# EAGLE design LED individual sign Board FINAL (EAGLE 7.2.0)
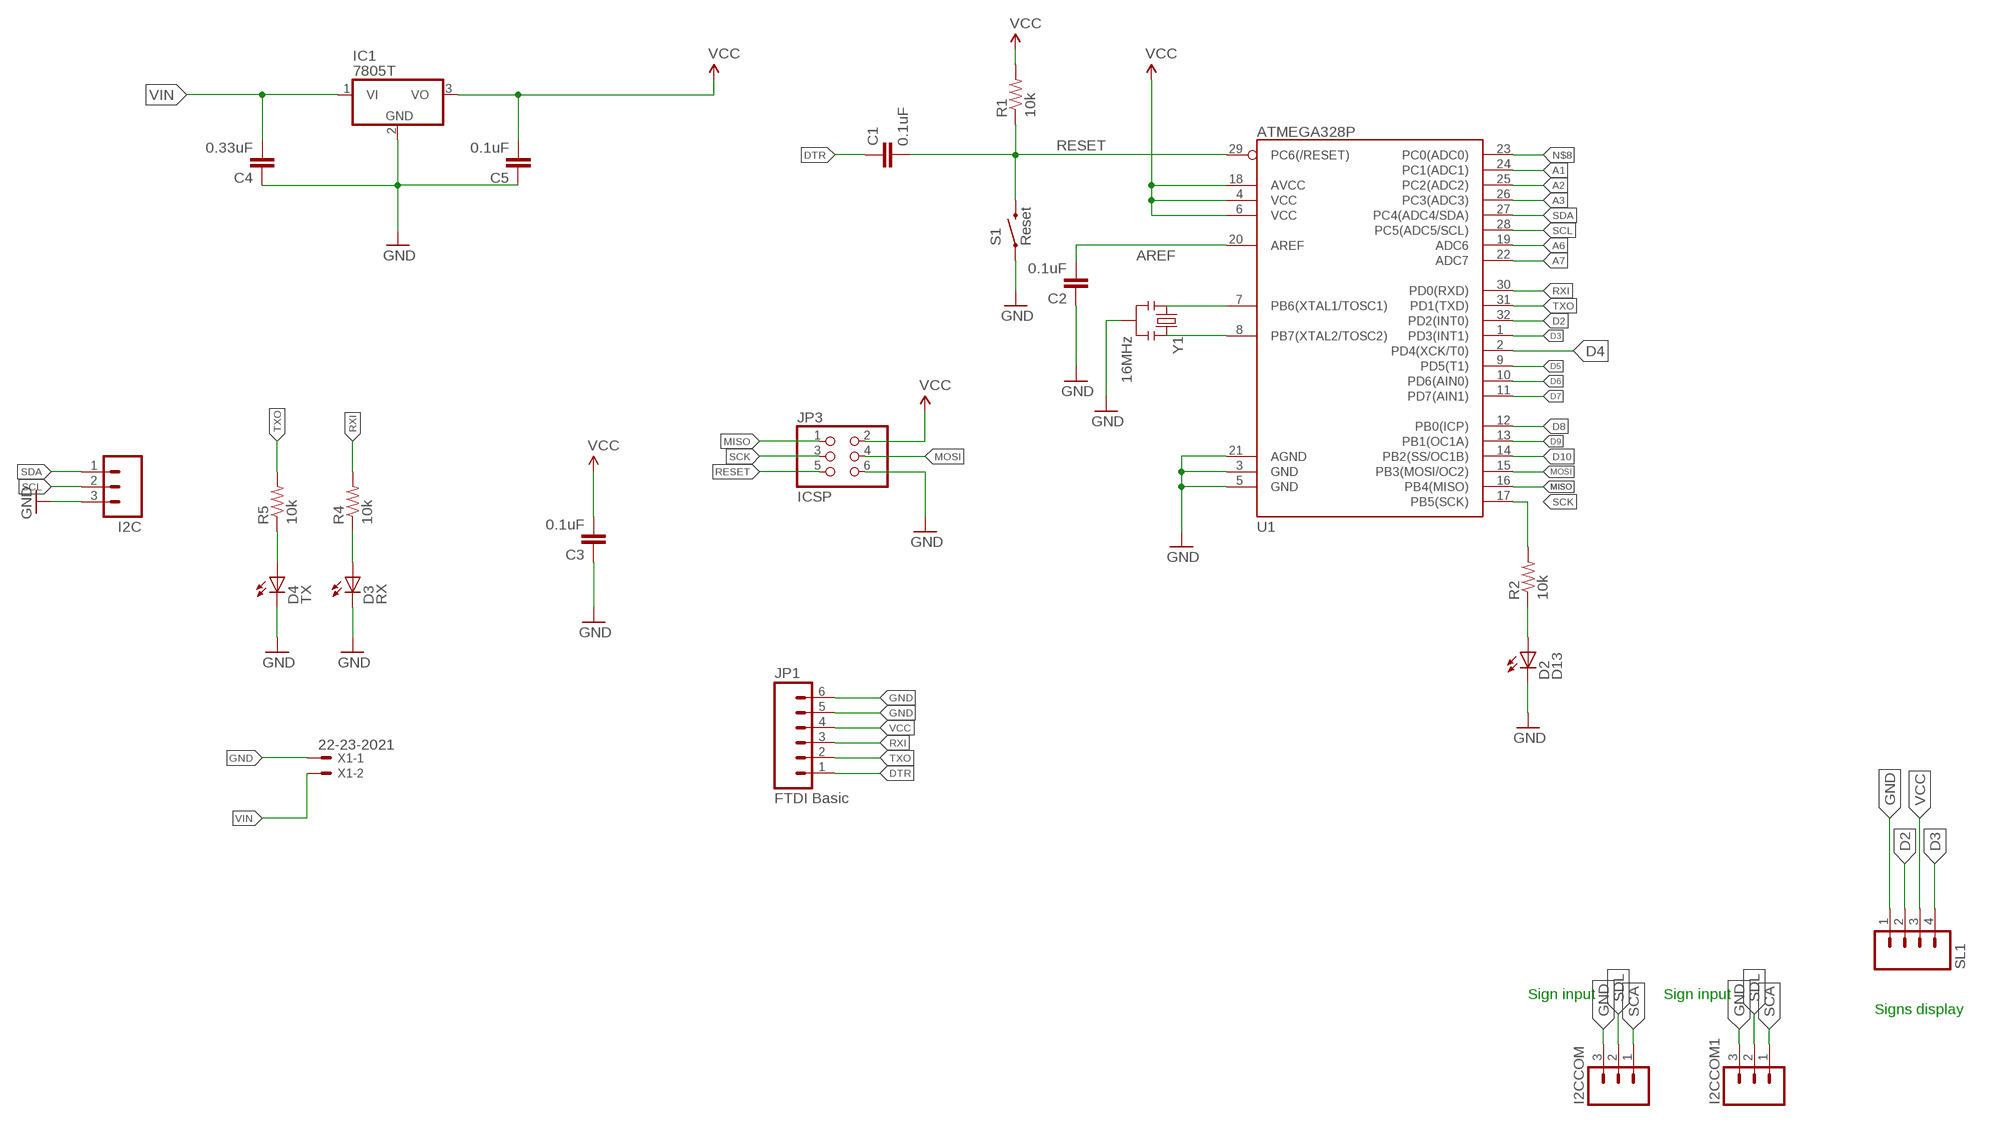
[diagram p0: schematic, sheet 1]

## Parts
C1  0.1uF  CAP0603-CAP  [0603-CAP]
C2  0.1uF  CAP0603-CAP  [0603-CAP]
C3  0.1uF  CAP0603-CAP  [0603-CAP]
C4  0.33uF  CAP0603-CAP  [0603-CAP]
C5  0.1uF  CAP0603-CAP  [0603-CAP]
D2  D13  LED-RED0603  [LED-0603]
D3  RX  LED-GREEN0603  [LED-0603]
D4  TX  LED-RED0603  [LED-0603]
I2C  M03PTH  [1X03]
I2CCOM  M03PTH  [1X03]
I2CCOM1  M03PTH  [1X03]
IC1  7805T  [TO220H]
JP1  FTDI Basic  M06SIP  [1X06]
JP3  ICSP  PINHD-2X3  [2X03]
R1  10k  RESISTOR0603-RES  [0603-RES]
R2  10k  RESISTOR0603-RES  [0603-RES]
R4  10k  RESISTOR0603-RES  [0603-RES]
R5  10k  RESISTOR0603-RES  [0603-RES]
S1  Reset  SWITCH-MOMENTARY-2SMD  [TACTILE_SWITCH_SMD]
SL1  M04  [04P]
U1  ATMEGA328P  ATMEGA328_SMT  [TQFP32-08]
X1  22-23-2021  [22-23-2021]
Y1  16MHz  RESONATOR16MHZ  [RESONATOR-SMD]

## Nets
A1: U1.24(PC1(ADC1))
A2: U1.25(PC2(ADC2))
A3: U1.26(PC3(ADC3))
A6: U1.19(ADC6)
A7: U1.22(ADC7)
AREF: C2.2 U1.20(AREF)
D2: SL1.2 U1.32(PD2(INT0))
D3: SL1.4 U1.1(PD3(INT1))
D4: U1.2(PD4(XCK/T0))
D5: U1.9(PD5(T1))
D6: U1.10(PD6(AIN0))
D7: U1.11(PD7(AIN1))
D8: U1.12(PB0(ICP))
D9: U1.13(PB1(OC1A))
D10: U1.14(PB2(SS/OC1B))
DTR: C1.1 JP1.1
GND: C2.1 C3.1 C4.1 C5.1 D2.C D3.C D4.C I2C.3 I2CCOM1.3 I2CCOM.3 IC1.2(GND) JP1.5 JP1.6 JP3.6 S1.1 SL1.1 U1.3(GND) U1.5(GND) U1.21(AGND) X1.1 Y1.2
MISO: JP3.1 U1.16(PB4(MISO))
MOSI: JP3.4 U1.15(PB3(MOSI/OC2))
N$1: U1.7(PB6(XTAL1/TOSC1)) Y1.1
N$2: U1.8(PB7(XTAL2/TOSC2)) Y1.3
N$4: D2.A R2.1
N$5: D3.A R4.1
N$6: D4.A R5.1
N$8: U1.23(PC0(ADC0))
RESET: C1.2 JP3.5 R1.1 S1.3 U1.29(PC6(/RESET))
RXI: JP1.3 R4.2 U1.30(PD0(RXD))
SCA: I2CCOM1.1 I2CCOM.1
SCK: JP3.3 R2.2 U1.17(PB5(SCK))
SCL: I2C.2 U1.28(PC5(ADC5/SCL))
SDA: I2C.1 U1.27(PC4(ADC4/SDA))
SDL: I2CCOM1.2 I2CCOM.2
TXO: JP1.2 R5.2 U1.31(PD1(TXD))
VCC: C3.2 C5.2 IC1.3(VO) JP1.4 JP3.2 R1.2 SL1.3 U1.4(VCC) U1.6(VCC) U1.18(AVCC)
VIN: C4.2 IC1.1(VI) X1.2

## Notes on the sheet
- Sign input | Sign input
- Signs display

## Library data of the parts
C1-C5 = SparkFun-Passives:CAP: Capacitor Standard 0603 ceramic capacitor, and 0.1" leaded capacitor.
D2 D4 = SparkFun-LED:LED-RED: Assorted Red LEDs LilyPad 1206- DIO-09912 1206- DIO-00809 0603- DIO-00819; PROD_ID: DIO-00819; VALUE: RED
D3 = SparkFun-LED:LED-GREEN: Various green LEDs Green LEDs used in SFE Production 0603- DIO-00821 LARGE- DIO-00862 LILYPAD- DIO-09910; PROD_ID: DIO-00821; VALUE: GREEN
I2C I2CCOM I2CCOM1 = SparkFun-Connectors:M03: Header 3 Standard 3-pin 0.1" header. Use with straight break away headers (SKU : PRT-00116), right angle break away headers (PRT-00553), swiss pins (PRT-00743), machine pins (PRT-00117), and female headers (PRT-00115). Molex polarized connector foot print use with SKU : PRT-08232 with associated crimp pins and housings.
IC1 = linear:78*: Positive VOLTAGE REGULATOR Source: http://cache.national.com/ds/LM/LM78L05.pdf http://www.fairchildsemi.com/ds/LM/LM7805.pdf
JP1 = SparkFun-Connectors:M06: Header 6 Standard 6-pin 0.1" header. Use with straight break away headers (SKU : PRT-00116), right angle break away headers (PRT-00553), swiss pins (PRT-00743), machine pins (PRT-00117), and female headers (PRT-00115). Molex polarized connector foot print use with SKU : PRT-08094 with associated crimp pins and housings. NOTES ON THE VARIANTS LOCK and LOCK_LONGPADS... This footprint was designed to help hold the alignment of a through-hole component (i.e. 6-pin header) while soldering it into place. You may notice that each hole has been shifted either up or down by 0.005 of an inch from it's more standard position (which is a perfectly straight line). This slight alteration caused the pins (the squares in the middle) to touch the edges of the holes. Because they are alternating, it causes a "brace" to hold the component in place. 0.005 has proven to be the perfect amount of "off-center" position when using our standard breakaway headers. Although looks a little odd when you look at the bare footprint, once you have a header in there, the alteration is very hard to notice. Also,if you push a header all the way into place, it is covered up entirely on the bottom side. This idea of altering the position of holes to aid alignment will be further integrated into the Sparkfun Library for other footprints. It can help hold any component with 3 or more connection pins.
JP3 = SparkFun-Connectors:PINHD-2X3: PIN HEADER
R1 R2 R4 R5 = SparkFun-Passives:RESISTOR: Resistor Basic schematic elements and footprints for 0603, 1206, and PTH resistors.
S1 = SparkFun-Electromechanical:SWITCH-MOMENTARY-2: Various NO switches- pushbuttons, reed, etc; PROD_ID: SWCH-08247
SL1 = con-amp-quick:M04: AMP QUICK CONNECTOR; OC_FARNELL: unknown; OC_NEWARK: unknown
U1 = SparkFun-DigitalIC:ATMEGA328_SMT: 32-Pin Atmega328 part Commonly used on Arduino compatible boards Available in QFP and QFN packages TQFP is IC-09069 QFN is non-stock; PROD_ID: IC-09069
X1 = con-molex:22-23-2021: .100" (2.54mm) Center Header - 2 Pin; MF: MOLEX; MPN: 22-23-2021; OC_FARNELL: 1462926; OC_NEWARK: 25C3832
Y1 = SparkFun-FreqCtrl:RESONATOR: Resonator Small SMD resonator. Used, eg, on the Arduino Pro/ Pro Mini boards. 8MHz- XTAL-08895 16MHz- XTAL-08900; PROD_ID: XTAL-08900

## Board
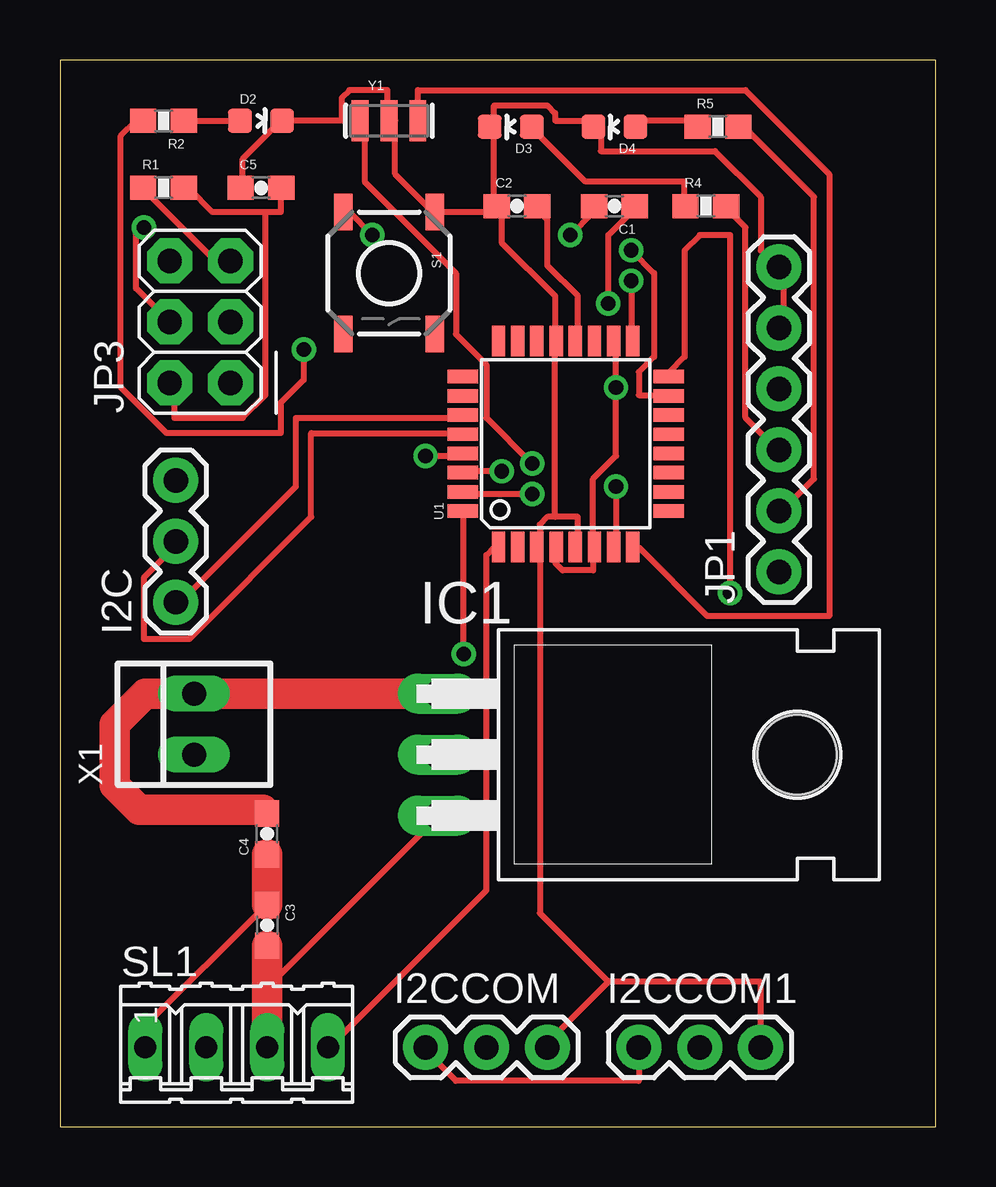
[diagram p1: board, top side]
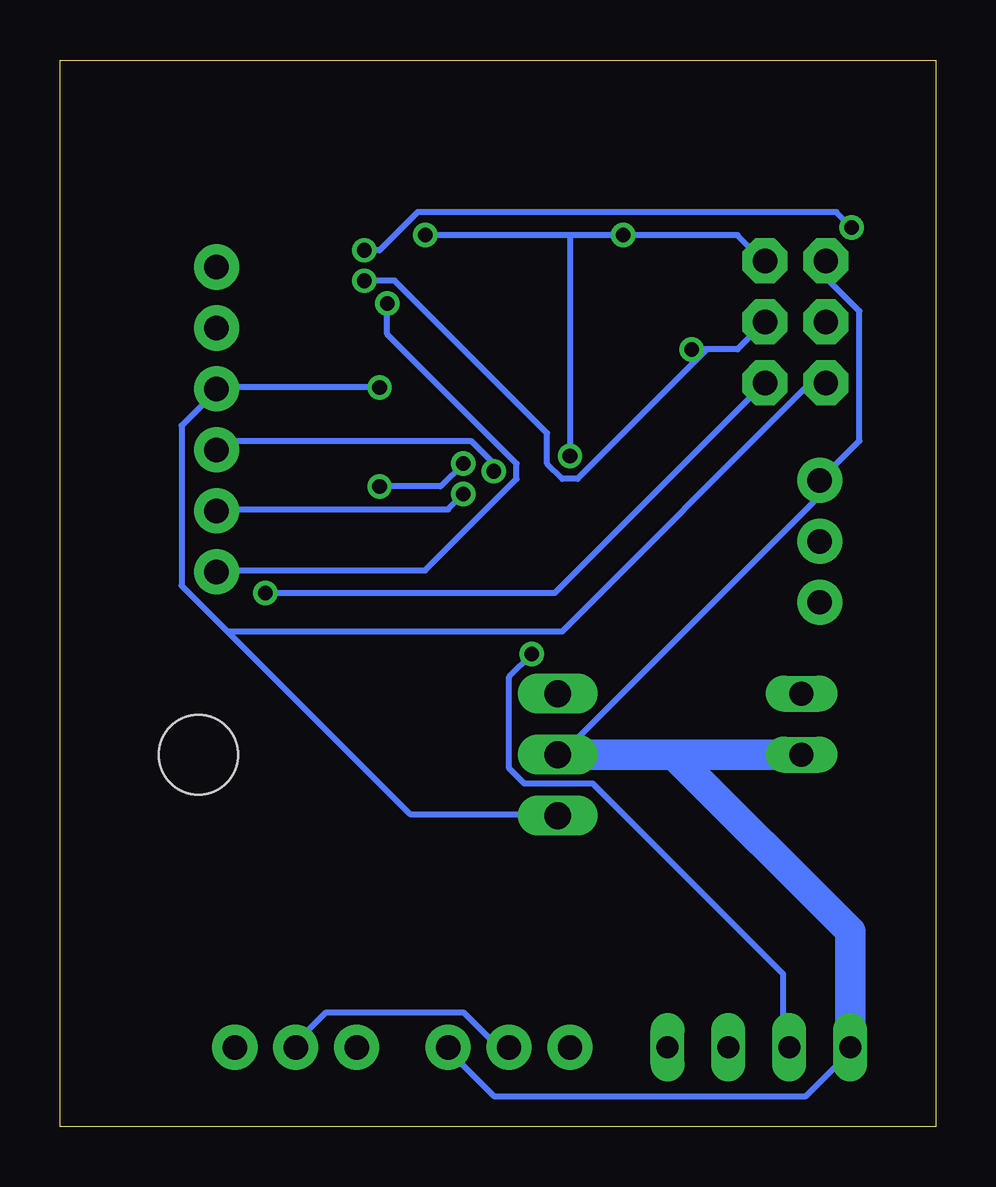
[diagram p2: board, bottom side, seen from below]

Size 36.5 x 44.44 mm. Coordinates in mm from the lower left corner, seen from the top.
Outline: 0,0 36.5,0 36.5,44.44 0,44.44 0,0
Copper layers (1*16): Top 0.035mm / dielectric 1.5mm / Bottom 0.035mm
Design rules "default": minimum track width 10mil, minimum drill 24mil, track to track 8mil, track to pad 8mil, pad to pad 8mil, via to via 8mil, smd to smd 8mil, copper to edge 40mil, drill to drill 8mil, minimum pad ring 10mil, minimum via ring 8mil, stop-mask expansion 4mil, vias tented up to drill 0mil, thermal gap 10mil

### Footprints (pad centres in the part's own frame; a part is rotated, then mirrored left to right if it is on the bottom)
0603-CAP = smd 1.1 x 1: 1 -0.85,0; 2 0.85,0
LED-0603 = smd 1 x 1: A 0,-0.877; C 0,0.877
1X03 = drill 1.016 pad 1.88: 1 0,0; 2 2.54,0; 3 5.08,0
TO220H = drill 1.118 long: 1 -2.54,-10.16; 2 0,-10.16; 3 2.54,-10.16 | hole 3.302: 0,4.826
1X06 = drill 1.016 pad 1.88: 1 0,0; 2 2.54,0; 3 5.08,0; 4 7.62,0; 5 10.16,0; 6 12.7,0
2X03 = drill 1.016 pad 1.88 octagon: 1 -2.54,-1.27; 2 -2.54,1.27; 3 0,-1.27; 4 0,1.27; 5 2.54,-1.27; 6 2.54,1.27
0603-RES = smd 1.1 x 1: 1 -0.85,0; 2 0.85,0
TACTILE_SWITCH_SMD = smd 1.524 x 0.762: 1 -2.54,1.905; 2 2.54,1.905; 3 -2.54,-1.905; 4 2.54,-1.905
04P = drill 0.914 long: 1 -3.81,0; 2 -1.27,0; 3 1.27,0; 4 3.81,0
TQFP32-08 = smd 1.27 x 0.559: 1 -4.293,2.8; 2 -4.293,2; 3 -4.293,1.2; 4 -4.293,0.4; 5 -4.293,-0.4; 6 -4.293,-1.2; 7 -4.293,-2; 8 -4.293,-2.8; 17 4.293,-2.8; 18 4.293,-2; 19 4.293,-1.2; 20 4.293,-0.4; 21 4.293,0.4; 22 4.293,1.2; 23 4.293,2; 24 4.293,2.8 | smd 0.559 x 1.27: 9 -2.8,-4.293; 10 -2,-4.293; 11 -1.2,-4.293; 12 -0.4,-4.293; 13 0.4,-4.293; 14 1.2,-4.293; 15 2,-4.293; 16 2.8,-4.293; 25 2.8,4.293; 26 2,4.293; 27 1.2,4.293; 28 0.4,4.293; 29 -0.4,4.293; 30 -1.2,4.293; 31 -2,4.293; 32 -2.8,4.293
22-23-2021 = drill 1 long: 1 -1.27,0; 2 1.27,0
RESONATOR-SMD = smd 0.7 x 1.7: 1 -1.2,0; 2 0,0; 3 1.2,0

### Placement (x,y rotation side)
C1  23.11,38.35 180 top
C2  19.05,38.35 0 top
C3  8.64,8.38 270 top
C4  8.64,12.19 90 top
C5  8.38,39.12 0 top
D2  8.38,41.91 270 top
D3  18.8,41.66 90 top
D4  23.11,41.66 90 top
I2C  4.83,21.84 90 top
I2CCOM  15.24,3.3 0 top
I2CCOM1  24.13,3.3 0 top
IC1  25.91,15.49 270 top
JP1  29.97,23.11 90 top
JP3  5.84,33.53 90 top
R1  4.32,39.12 0 top
R2  4.32,41.91 180 top
R4  26.92,38.35 0 top
R5  27.43,41.66 0 top
S1  13.72,35.56 270 top
SL1  7.37,3.3 0 top
U1  21.08,28.45 90 top
X1  5.59,16.76 90 top
Y1  13.72,41.91 0 top

### Tracks (layer width: path | path; a pad name or v marks a point on that pad's centre or on a via)
AREF
  Top 0.254: C2.2 20,38.1 20.32,37.78 20.32,35.88 21.59,34.61 21.59,33.02 U1.20
D2  (via drill 0.61)
  Top 0.254: v16.83,19.68 16.83,25.4 U1.32
  Bottom 0.254: v16.83,19.68 17.78,18.73 17.78,14.92 17.14,14.29 14.29,14.29 6.35,6.35 6.35,3.49 SL1.2
D3
  Top 0.254: U1.1 18.1,24.13 17.78,23.81 17.78,9.84 11.43,3.49 SL1.4
DTR  (via drill 0.61)
  Top 0.254: v22.86,34.29 22.86,37.15 23.81,38.1 C1.1
  Bottom 0.254: v22.86,34.29 22.86,33.02 17.46,27.62 17.46,26.99 21.27,23.18 29.84,23.18 JP1.1
GND
  Top 0.254: C3.1 8.26,8.89 3.81,4.45 3.81,3.49 SL1.1 | 22.86,6.03 20.32,3.49 I2CCOM.3 | 22.86,6.03 29.21,6.03 I2CCOM1.3 | 20.64,25.4 21.59,25.4 21.59,24.45 U1.5 | 20.64,25.4 20.32,25.4 20,25.08 20,24.45 U1.3 20,24.13 20,8.89 22.86,6.03 | 20.64,25.4 20.64,32.7 U1.21 20.64,33.02 20.64,34.61 18.41,36.83 18.41,38.1 C2.1 | JP1.5 30.16,33.34 30.16,35.56 JP1.6 29.84,35.88 29.21,36.51 29.21,38.73 27.3,40.64 22.54,40.64 22.54,41.59 D4.C 22.22,41.91 20.64,41.91 20.64,42.23 20.32,42.55 18.1,42.55 18.1,41.91 D3.C 18.1,41.59 18.1,38.42 C2.1 | C5.1 7.62,39.37 7.62,40.32 9.21,41.91 D2.C 11.75,41.91 11.75,42.86 12.06,43.18 13.65,43.18 13.65,41.91 Y1.2 13.97,41.91 13.97,39.69 15.56,38.1 S1.1 18.1,38.1 C2.1
  Top 1.27: C4.1 C3.1
  Bottom 0.254: IC1.2 15.24,15.88 5.08,26.04 5.08,26.67 I2C.3 3.17,28.57 3.17,33.97 4.45,35.24 4.45,35.88 JP3.6 | SL1.1 3.81,2.86 5.4,1.27 18.41,1.27 20.32,3.17 I2CCOM.3
  Bottom 1.27: SL1.1 3.56,8.13 10.92,15.49 IC1.2 X1.1
MISO  (via drill 0.61)
  Top 0.254: v27.94,22.23 27.94,37.15 26.67,37.15 26.04,36.51 26.04,32.07 25.4,31.43 U1.16
  Bottom 0.254: v27.94,22.23 15.88,22.23 JP3.1
MOSI  (via drill 0.61)
  Top 0.254: v23.81,36.51 24.77,35.56 24.77,32.07 24.13,31.43 24.13,30.48 25.08,30.48 U1.15 | v3.49,37.47 3.17,37.15 3.17,34.92 JP3.4
  Bottom 0.254: v23.81,36.51 23.18,36.51 21.59,38.1 4.13,38.1 v3.49,37.47
N$1  (via drill 0.61)
  Top 0.254: v23.18,26.67 23.18,24.45 U1.7 | v19.68,27.62 17.78,29.53 17.78,31.75 16.51,33.02 16.51,35.56 12.7,39.37 12.7,41.91 Y1.1
  Bottom 0.254: v23.18,26.67 20.64,26.67 v19.68,27.62
N$2
  Top 0.254: U1.8 24.13,24.13 26.99,21.27 32.07,21.27 32.07,39.69 28.57,43.18 14.92,43.18 Y1.3
N$4
  Top 0.254: R2.1 D2.A
N$5
  Top 0.254: D3.A 19.68,41.59 21.91,39.37 26.04,39.37 26.04,38.42 R4.1
N$6
  Top 0.254: D4.A 24.13,41.91 26.35,41.91 R5.1
RESET  (via drill 0.61)
  Top 0.254: v21.27,37.15 22.22,38.1 C1.2 | R1.1 3.49,39.05 6.35,36.2 6.98,36.2 JP3.5 | v15.24,27.94 16.51,27.94 U1.29 | v13.02,37.15 12.06,38.1 S1.3
  Bottom 0.254: 15.24,37.15 v13.02,37.15 8.26,37.15 7.3,36.2 JP3.5 | 15.24,37.15 v21.27,37.15 | 15.24,37.15 v15.24,27.94
RXI  (via drill 0.61)
  Top 0.254: R4.2 27.94,38.1 28.57,37.47 28.57,29.53 29.84,28.26 JP1.3 | v18.41,27.3 16.83,27.3 U1.30
  Bottom 0.254: v18.41,27.3 18.41,27.62 19.37,28.57 29.53,28.57 29.84,28.26 JP1.3
SCA
  Top 0.254: I2CCOM1.1 24.13,1.91 16.51,1.91 15.24,3.17 I2CCOM.1
SCK  (via drill 0.61)
  Top 0.254: v10.16,32.38 10.16,31.11 9.21,30.16 9.21,28.89 4.45,28.89 2.54,30.8 2.54,41.27 3.17,41.91 R2.2 | v23.81,35.24 23.81,33.02 U1.17
  Bottom 0.254: 9.53,32.38 8.26,32.38 JP3.3 | 9.53,32.38 v10.16,32.38 | v23.81,35.24 22.54,35.24 16.19,28.89 16.19,27.62 15.56,26.99 14.92,26.99 9.53,32.38
SCL
  Top 0.254: U1.28 16.51,28.89 10.48,28.89 10.48,25.4 5.4,20.32 3.49,20.32 3.49,22.86 4.76,24.13 I2C.2
SDA
  Top 0.254: U1.27 16.51,29.53 9.84,29.53 9.84,26.67 5.08,21.91 I2C.1
SDL
  Bottom 0.254: I2CCOM.2 17.78,3.49 18.41,3.49 19.68,4.76 25.4,4.76 26.67,3.49 I2CCOM1.2
TXO  (via drill 0.61)
  Top 0.254: R5.2 28.57,41.59 31.43,38.73 31.43,26.99 30.16,25.72 JP1.2 | v19.68,26.35 16.83,26.35 U1.31
  Bottom 0.254: v19.68,26.35 20.32,25.72 29.84,25.72 JP1.2
VCC  (via drill 0.61)
  Top 0.254: 8.57,38.1 9.21,38.1 9.21,39.05 C5.2 | 8.57,38.1 6.35,38.1 5.4,39.05 R1.2 | 8.57,38.1 8.57,30.48 7.62,29.53 4.76,29.53 4.76,30.8 JP3.2 | IC1.3 15.56,12.7 9.21,6.35 8.64,6.35 | U1.4 20.64,24.13 20.64,23.5 20.95,23.18 22.22,23.18 22.22,24.13 U1.6 22.22,24.45 22.22,26.99 23.18,27.94 v23.18,30.8 23.18,32.7 U1.18
  Top 1.27: C3.2 8.64,6.35 SL1.3
  Bottom 0.254: v23.18,30.8 29.84,30.8 JP1.4 30.16,30.48 31.43,29.21 31.43,22.54 29.53,20.64 | 29.53,20.64 21.91,13.02 15.88,13.02 IC1.3 | 29.53,20.64 15.56,20.64 5.4,30.8 4.76,30.8 JP3.2
VIN
  Top 0.406: 8.47,13.21 C4.2
  Top 1.27: 8.47,13.21 3.3,13.21 2.29,14.22 2.29,16.76 3.56,18.03 X1.2 IC1.1